# Altium schematic sheet LTC2194_2.SchDoc
size A; SheetNumber: 7; SheetTotal: 24
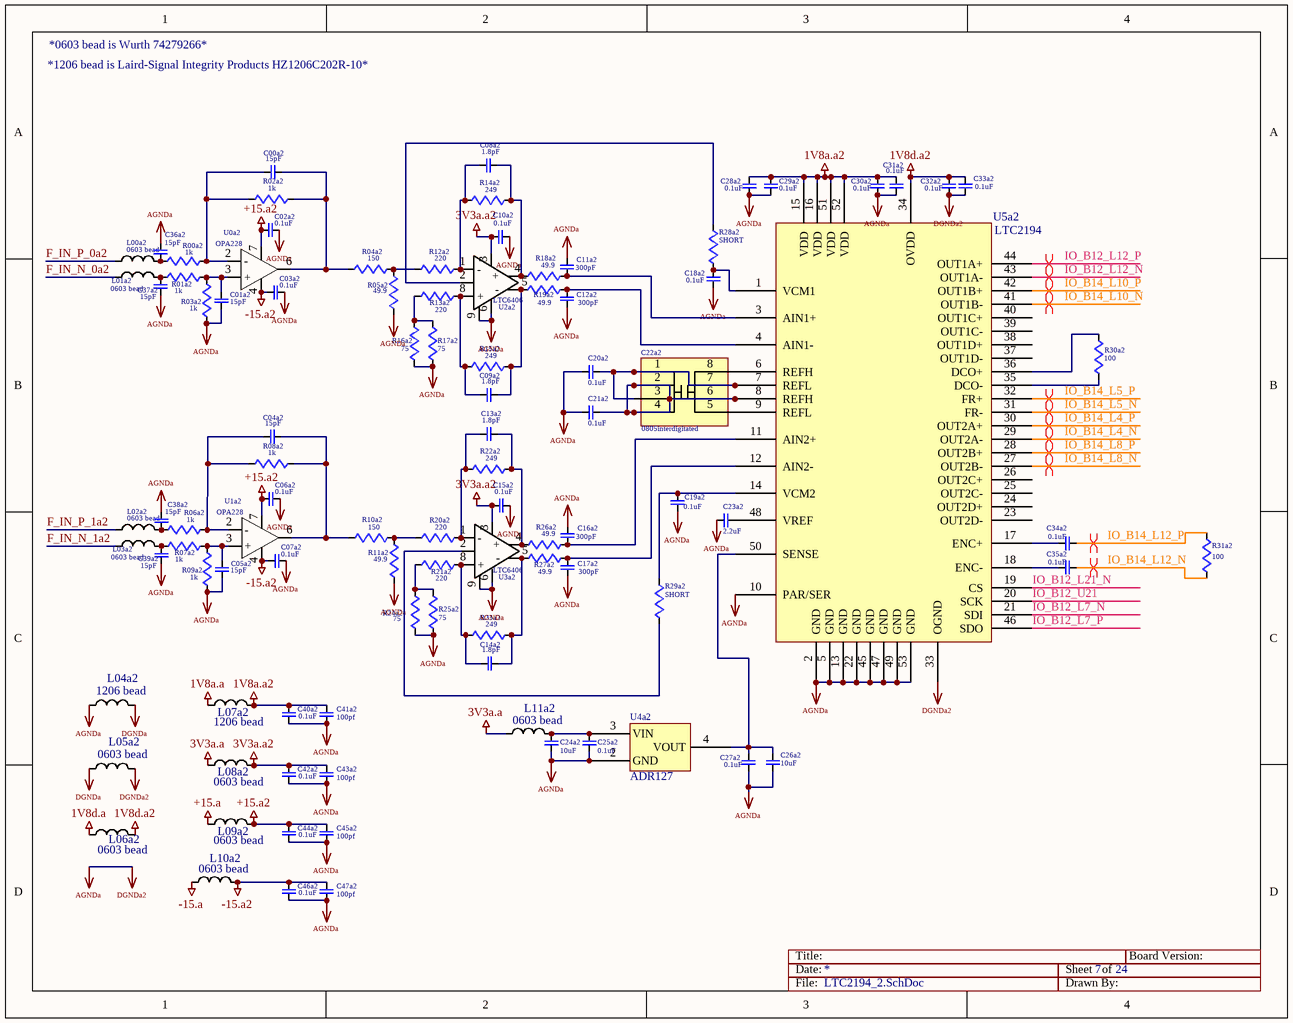
[diagram p0: LTC2194_2.SchDoc]

## Parts
C00a2  15pF  [0603]
C01a2  15pF  [0603]
C02a2  0.1uF  [0603]
C03a2  0.1uF  [0603]
C04a2  15pF  [0603]
C05a2  15pF  [0603]
C06a2  0.1uF  [0603]
C07a2  0.1uF  [0603]
C08a2  1.8pF  [0603]
C09a2  1.8pF  [0603]
C10a2  0.1uF  [0603]
C11a2  300pF  [0603]
C12a2  300pF  [0603]
C13a2  1.8pF  [0603]
C14a2  1.8pF  [0603]
C15a2  0.1uF  [0603]
C16a2  300pF  [0603]
C17a2  300pF  [0603]
C18a2  0.1uF  [0402]
C19a2  0.1uF  [0402]
C20a2  0.1uF  [0402]
C21a2  0.1uF  [0402]
C22a2  0805interdigitated  [0805int]
C23a2  2.2uF  [0402]
C24a2  10uF  [0603]
C25a2  0.1uF  [0603]
C26a2  10uF  [0603]
C27a2  0.1uF  [0603]
C28a2  0.1uF  [0402]
C29a2  0.1uF  [0402]
C30a2  0.1uF  [0402]
C31a2  0.1uF  [0402]
C32a2  0.1uF  [0402]
C33a2  0.1uF  [0402]
C34a2  0.1uF  [0402]
C35a2  0.1uF  [0402]
C36a2  15pF  [0603]
C37a2  15pF  [0603]
C38a2  15pF  [0603]
C39a2  15pF  [0603]
C40a2  0.1uF  [0603]
C41a2  100pf  [0603]
C42a2  0.1uF  [0603]
C43a2  100pf  [0603]
C44a2  0.1uF  [0603]
C45a2  100pf  [0603]
C46a2  0.1uF  [0603]
C47a2  100pf  [0603]
L00a2  0603 bead  [0603]
L01a2  0603 bead  [0603]
L02a2  0603 bead  [0603]
L03a2  0603 bead  [0603]
L04a2  1206 bead  [1206]
L05a2  0603 bead  [0603]
L06a2  0603 bead  [0603]
L07a2  1206 bead  [1206]
L08a2  0603 bead  [0603]
L09a2  0603 bead  [0603]
L10a2  0603 bead  [0603]
L11a2  0603 bead  [0603]
R00a2  1k  [0603]
R01a2  1k  [0603]
R02a2  1k  [0603]
R03a2  1k  [0603]
R04a2  150  [0603]
R05a2  49.9  [0603]
R06a2  1k  [0603]
R07a2  1k  [0603]
R08a2  1k  [0603]
R09a2  1k  [0603]
R10a2  150  [0603]
R11a2  49.9  [0603]
R12a2  220  [0603]
R13a2  220  [0603]
R14a2  249  [0603]
R15a2  249  [0603]
R16a2  75  [0603]
R17a2  75  [0603]
R18a2  49.9  [0603]
R19a2  49.9  [0603]
R20a2  220  [0603]
R21a2  220  [0603]
R22a2  249  [0603]
R23a2  249  [0603]
R24a2  75  [0603]
R25a2  75  [0603]
R26a2  49.9  [0603]
R27a2  49.9  [0603]
R28a2  SHORT  [0603]
R29a2  SHORT  [0603]
R30a2  100  [0603]
R31a2  100  [0402]
U0a2  OPA228  [8SOIC]
U1a2  OPA228  [8SOIC]
U2a2  LTC6406  [8MSOP]
U3a2  LTC6406  [8MSOP]
U4a2  ADR127  [6TSOT]
U5a2  LTC2194  [52QFN]

## Nets
1V8a.a: L07a2.1
1V8a.a2: C28a2.1 C29a2.1 C30a2.1 C31a2.1 C40a2.1 C41a2.1 L07a2.2 U5a2.15(VDD) U5a2.16(VDD) U5a2.51(VDD) U5a2.52(VDD)
1V8d.a: L06a2.1
1V8d.a2: C32a2.1 C33a2.2 L06a2.2 U5a2.34(OVDD)
3V3a.a: L08a2.1 L11a2.1
3V3a.a2: C10a2.1 C15a2.1 C42a2.1 C43a2.1 L08a2.2 U2a2.3(V+) U3a2.3(V+)
+15.a: L09a2.1
+15.a2: C02a2.2 C06a2.2 C44a2.1 C45a2.1 L09a2.2 U0a2.7(V+) U1a2.7(V+)
-15.a: L10a2.1
-15.a2: C03a2.2 C07a2.2 C46a2.1 C47a2.1 L10a2.2 U0a2.4(V-) U1a2.4(V-)
AGNDa: C01a2.2 C02a2.1 C03a2.1 C05a2.2 C06a2.1 C07a2.1 C10a2.2 C11a2.2 C12a2.1 C15a2.2 C16a2.2 C17a2.1 C18a2.1 C19a2.1 C20a2.2 C21a2.2 C23a2.2 C24a2.2 C25a2.2 C26a2.2 C27a2.2 C28a2.2 C29a2.2 C30a2.2 C31a2.2 C32a2.2 C33a2.1 C36a2.1 C37a2.2 C38a2.1 C39a2.2 C40a2.2 C41a2.2 C42a2.2 C43a2.2 C44a2.2 C45a2.2 C46a2.2 C47a2.2 L04a2.1 L05a2.2 R03a2.1 R05a2.2 R09a2.1 R11a2.2 R16a2.2 R17a2.2 R24a2.2 R25a2.2 U2a2.6(V-) U2a2.9(V-) U3a2.6(V-) U3a2.9(V-) U4a2.2(GND) U5a2.2(GND) U5a2.5(GND) U5a2.10(PAR/SER) U5a2.13(GND) U5a2.22(GND) U5a2.33(OGND) U5a2.45(GND) U5a2.47(GND) U5a2.49(GND) U5a2.53(GND)  [also labelled DGNDa2]
DGNDa: L04a2.2 L05a2.1
F_IN_N_0a2: L01a2.1
F_IN_N_1a2: L03a2.1
F_IN_P_0a2: L00a2.1
F_IN_P_1a2: L02a2.1
IO_B12_L7_N: U5a2.21(SDI)
IO_B12_L7_P: U5a2.46(SDO)
IO_B12_L12_N: U5a2.43(OUT1A-)
IO_B12_L12_P: U5a2.44(OUT1A+)
IO_B12_L21_N: U5a2.19(CS)
IO_B12_U21: U5a2.20(SCK)
IO_B14_L4_N: U5a2.29(OUT2A-)
IO_B14_L4_P: U5a2.30(OUT2A+)
IO_B14_L5_N: U5a2.31(FR-)
IO_B14_L5_P: U5a2.32(FR+)
IO_B14_L8_N: U5a2.27(OUT2B-)
IO_B14_L8_P: U5a2.28(OUT2B+)
IO_B14_L10_N: U5a2.41(OUT1B-)
IO_B14_L10_P: U5a2.42(OUT1B+)
IO_B14_L12_N: C35a2.1 R31a2.2
IO_B14_L12_P: C34a2.1 R31a2.1
NetC00a2_1: C00a2.1 R00a2.1 R02a2.2 U0a2.2(-)
NetC00a2_2: C00a2.2 R02a2.1 R04a2.2 U0a2.6(OUT)
NetC01a2_1: C01a2.1 R01a2.1 R03a2.2 U0a2.3(+)
NetC04a2_1: C04a2.1 R06a2.1 R08a2.2 U1a2.2(-)
NetC04a2_2: C04a2.2 R08a2.1 R10a2.2 U1a2.6(OUT)
NetC05a2_1: C05a2.1 R07a2.1 R09a2.2 U1a2.3(+)
NetC08a2_1: C08a2.1 R12a2.1 R14a2.2 U2a2.1(-)
NetC08a2_2: C08a2.2 R14a2.1 R18a2.2 U2a2.4(+)
NetC09a2_1: C09a2.1 R13a2.1 R15a2.2 U2a2.8(+)
NetC09a2_2: C09a2.2 R15a2.1 R19a2.2 U2a2.5(-)
NetC11a2_1: C11a2.1 R18a2.1 U5a2.3(AIN1+)
NetC12a2_2: C12a2.2 R19a2.1 U5a2.4(AIN1-)
NetC13a2_1: C13a2.1 R20a2.1 R22a2.2 U3a2.1(-)
NetC13a2_2: C13a2.2 R22a2.1 R26a2.2 U3a2.4(+)
NetC14a2_1: C14a2.1 R21a2.1 R23a2.2 U3a2.8(+)
NetC14a2_2: C14a2.2 R23a2.1 R27a2.2 U3a2.5(-)
NetC16a2_1: C16a2.1 R26a2.1 U5a2.11(AIN2+)
NetC17a2_2: C17a2.2 R27a2.1 U5a2.12(AIN2-)
NetC18a2_2: C18a2.2 R28a2.2 U5a2.1(VCM1)
NetC19a2_2: C19a2.2 R29a2.1 U5a2.14(VCM2)
NetC20a2_1: C20a2.1 C22a2.1 C22a2.3 C22a2.7 U5a2.7(REFL)
NetC21a2_1: C21a2.1 C22a2.2 C22a2.4 C22a2.6 U5a2.8(REFH)
NetC22a2_5: C22a2.5 U5a2.9(REFL)
NetC22a2_8: C22a2.8 U5a2.6(REFH)
NetC23a2_1: C23a2.1 U5a2.48(VREF)
NetC24a2_1: C24a2.1 C25a2.1 L11a2.2 U4a2.3(VIN)
NetC26a2_1: C26a2.1 C27a2.1 U4a2.4(VOUT) U5a2.50(SENSE)
NetC34a2_2: C34a2.2 U5a2.17(ENC+)
NetC35a2_2: C35a2.2 U5a2.18(ENC-)
NetC36a2_2: C36a2.2 L00a2.2 R00a2.2
NetC37a2_1: C37a2.1 L01a2.2 R01a2.2
NetC38a2_2: C38a2.2 L02a2.2 R06a2.2
NetC39a2_1: C39a2.1 L03a2.2 R07a2.2
NetR04a2_1: R04a2.1 R05a2.1 R12a2.2
NetR10a2_1: R10a2.1 R11a2.1 R20a2.2
NetR13a2_2: R13a2.2 R16a2.1 R17a2.1
NetR21a2_2: R21a2.2 R24a2.1 R25a2.1
NetR28a2_1: R28a2.1 U2a2.2(VOCM)
NetR29a2_2: R29a2.2 U3a2.2(VOCM)
NetR30a2_1: R30a2.1 U5a2.36(DCO+)
NetR30a2_2: R30a2.2 U5a2.35(DCO-)

Not connected (* = marked no-connect by the designer): U5a2 23(OUT2D-) 24(OUT2D+) 25(OUT2C-) 26(OUT2C+) 37(OUT1D-) 38(OUT1D+) 39(OUT1C-) 40(OUT1C+)

## Layout directives
differential pair: IO_B12_L12_N, IO_B12_L12_P, IO_B14_L4_N, IO_B14_L4_P, IO_B14_L5_N, IO_B14_L5_P, IO_B14_L8_N, IO_B14_L8_P, IO_B14_L10_N, IO_B14_L10_P, IO_B14_L12_N, IO_B14_L12_P

## Notes on the sheet
- *1206 bead is Laird-Signal Integrity Products HZ1206C202R-10*
- *0603 bead is Wurth 74279266*
- Title:
- Date:
- Sheet
- of
- Board Version:
- File:
- Drawn By:

## Library data of the parts
C00a2 C01a2 C02a2 C03a2 C04a2 C05a2 C06a2 C07a2 C08a2 C09a2 C10a2 C11a2 C12a2 C13a2 C14a2 C15a2 C16a2 C17a2 C18a2 C19a2 C20a2 C21a2 C23a2 C24a2 C25a2 C26a2 C27a2 C28a2 C29a2 C30a2 C31a2 C32a2 C33a2 C34a2 C35a2 C36a2 C37a2 C38a2 C39a2 C40a2 C41a2 C42a2 C43a2 C44a2 C45a2 C46a2 C47a2 = CAP
C22a2 = 0805intCap
L00a2 L01a2 L02a2 L03a2 L04a2 L05a2 L06a2 L07a2 L08a2 L09a2 L10a2 L11a2 = INDUCTOR
R00a2 R01a2 R02a2 R03a2 R04a2 R05a2 R06a2 R07a2 R08a2 R09a2 R10a2 R11a2 R12a2 R13a2 R14a2 R15a2 R16a2 R17a2 R18a2 R19a2 R20a2 R21a2 R22a2 R23a2 R24a2 R25a2 R26a2 R27a2 R28a2 R29a2 R30a2 R31a2 = RES
U0a2 U1a2 = LF356
U4a2 = ADR12x